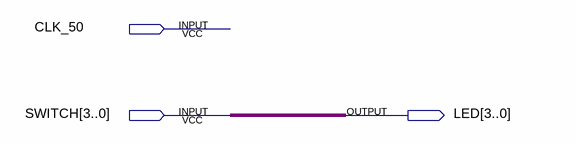
[diagram p0: schematic sheet]
// Quartus schematic top.bdf as structural Verilog: 0 symbols, 3 pins
module top (
  input  CLK_50,
  input  [3:0] SWITCH,
  output [3:0] LED
);


  assign LED = SWITCH;
endmodule
